# Altium schematic sheet Panel2.SchDoc
size A4
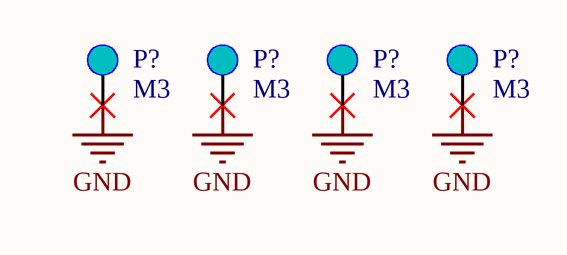
[diagram p0: Panel2.SchDoc]

## Parts
(Parts that share a designator on the sheet are numbered #1, #2 ... from top to bottom, then left to right.)
P?#1  M3  [M3_4.0]
P?#2  M3  [M3_4.0]
P?#3  M3  [M3_4.0]
P?#4  M3  [M3_4.0]

## Nets
GND: P?#1.1 P?#2.1 P?#3.1 P?#4.1